# Altium schematic sheet Sheet1.SchDoc
size A4; SheetNumber: 1; SheetTotal: 1
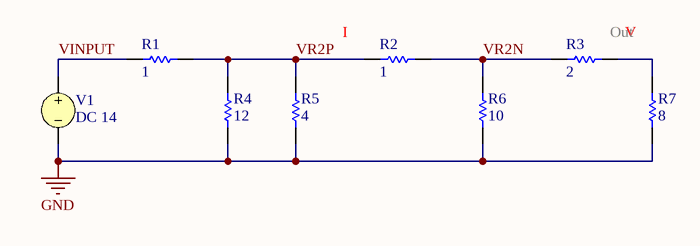
[diagram p0: Sheet1.SchDoc]

## Parts
R1  value 1  (hidden comment: Resistor)
R2  value 1  (hidden comment: Resistor)
R3  value 2  (hidden comment: Resistor)
R4  value 12  (hidden comment: Resistor)
R5  value 4  (hidden comment: Resistor)
R6  value 10  (hidden comment: Resistor)
R7  value 8  (hidden comment: Resistor)
V1  DC 14

## Nets
GND: R4.1 R5.1 R6.2 R7.1 V1.2
VINPUT: R1.1 V1.1
VR2N: R2.1 R3.1 R6.1
VR2P: R1.2 R2.2 R4.2 R5.2
NetR3_2: R3.2 R7.2

## Library data of the parts
R1-R7 = Resistor: TC1: 0; SimulationGenericComponent: True; TC2: 0
V1 = VSRC: Voltage Source; Note: PCB Footprint - Not required; AC Magnitude: 1; AC Phase: 0; Value: 14; Published: 8-Jun-2000; LatestRevisionDate: 17-Jul-2002; LatestRevisionNote: Re-released for DXP Platform.; PackageReference: Not Applicable; Publisher: Altium Limited